# Altium schematic sheet Sheet1.SchDoc
size A2; SheetNumber: 1; SheetTotal: 1
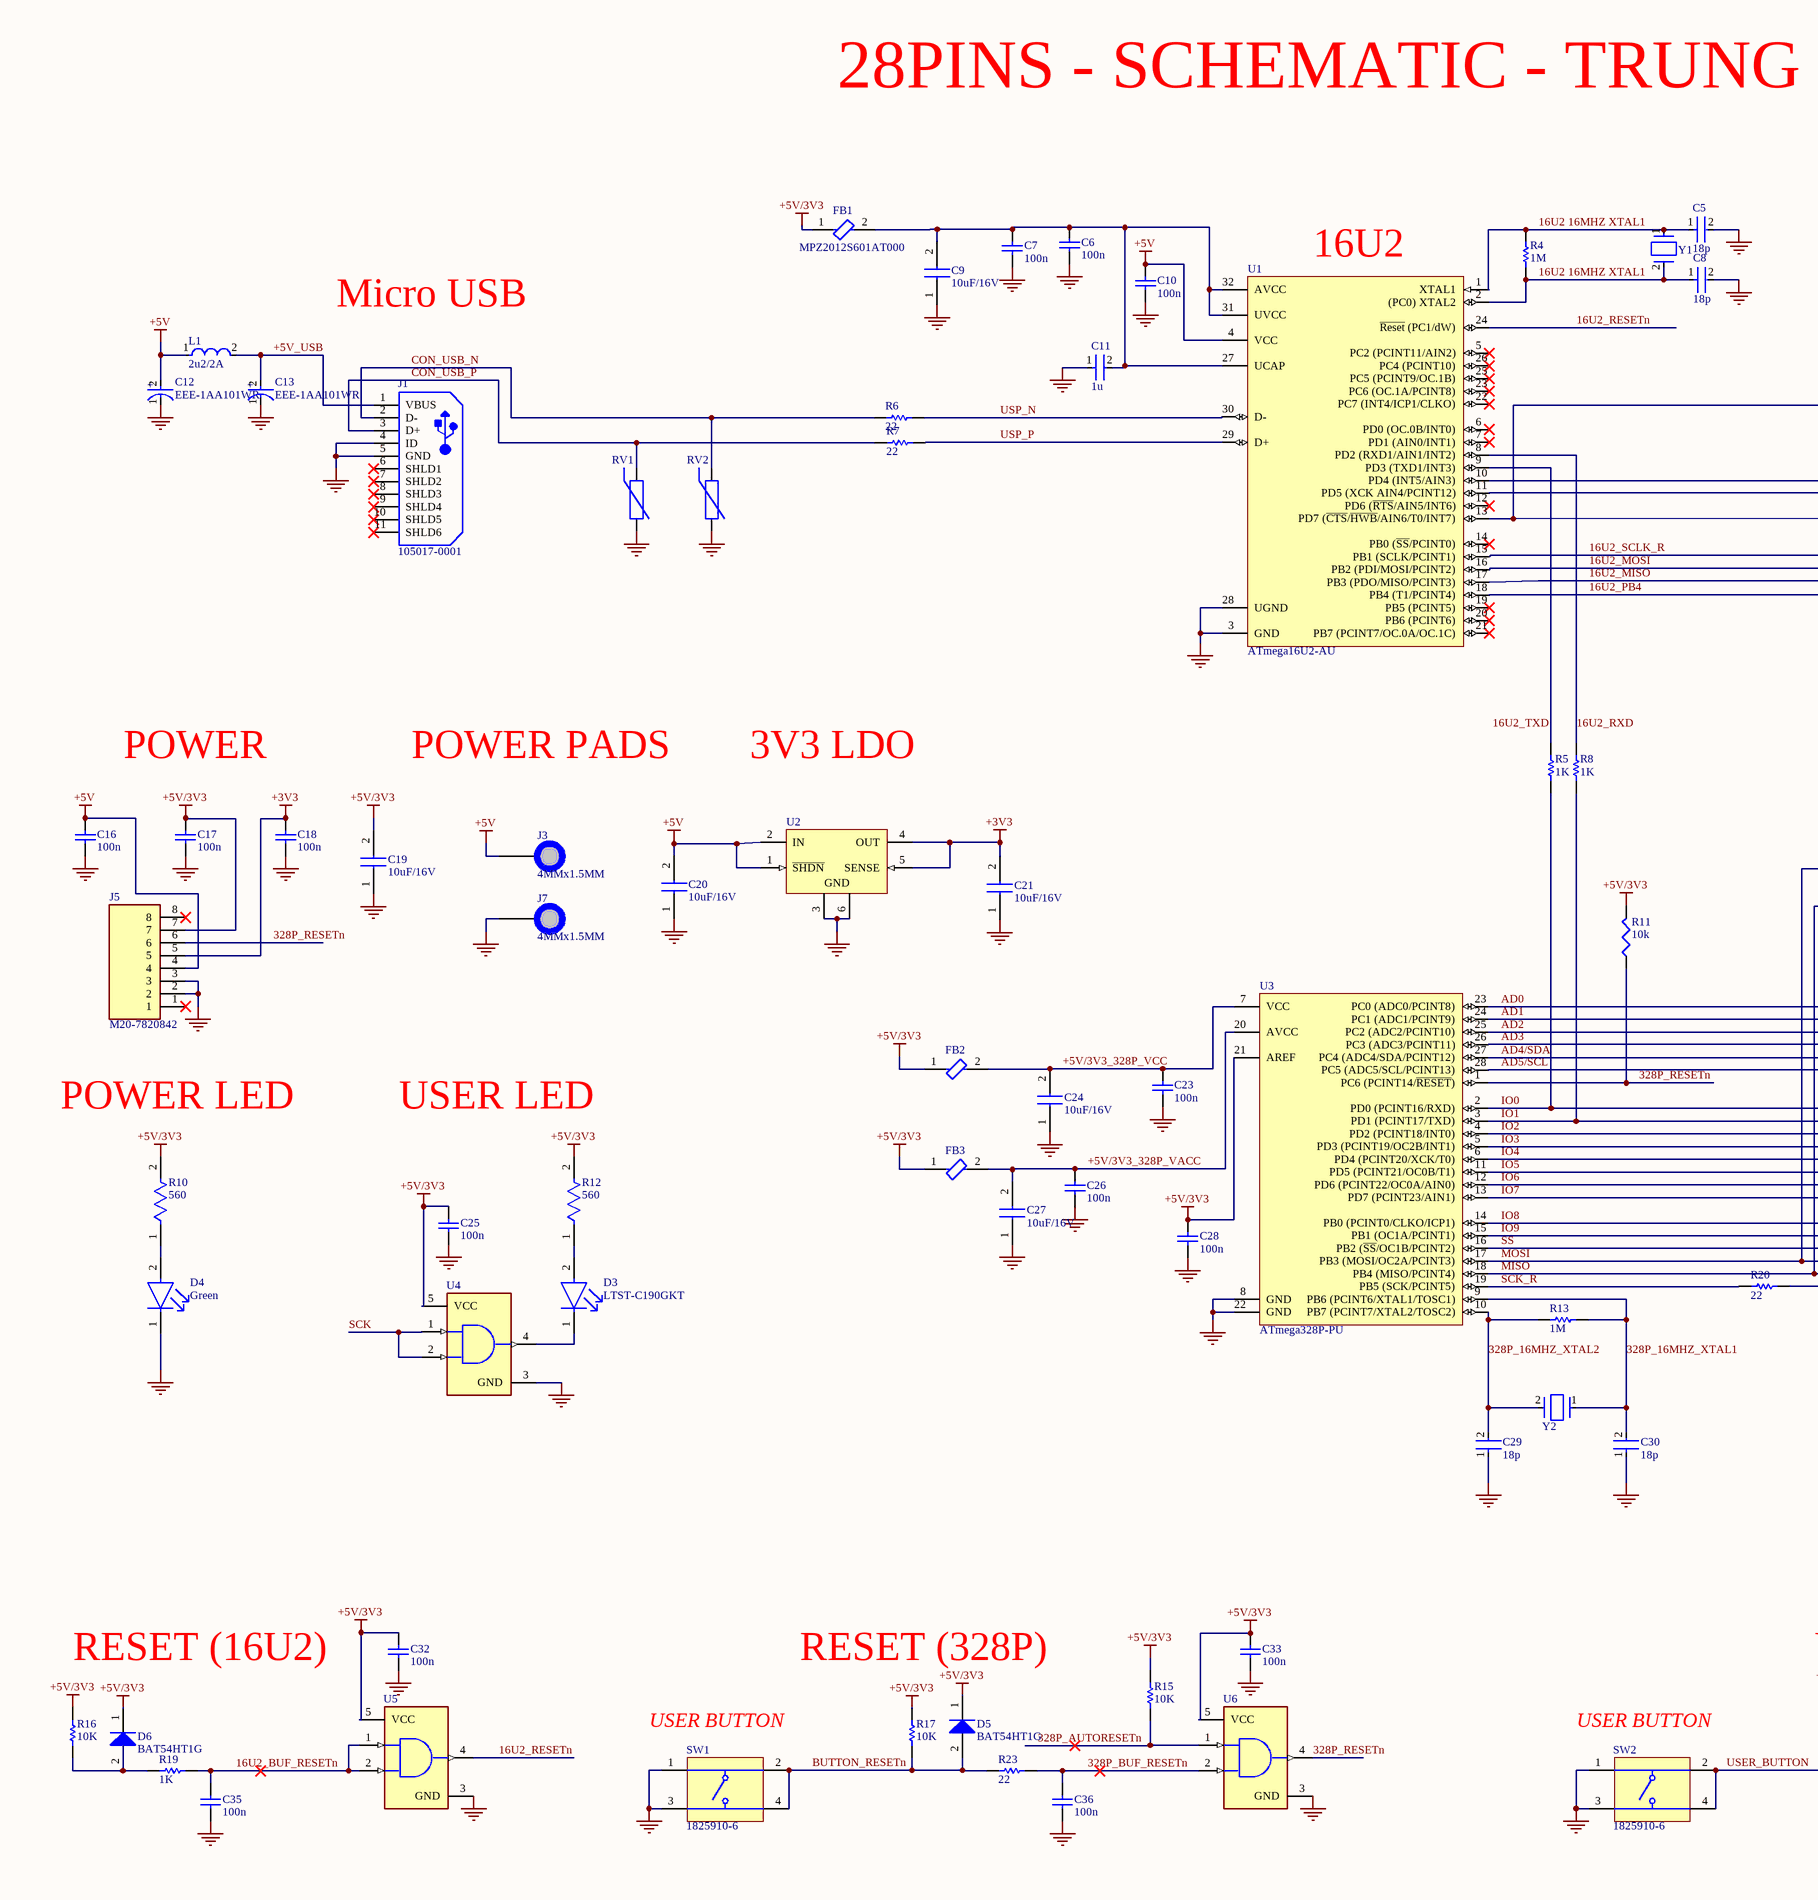
[diagram p0: Sheet1.SchDoc, left]
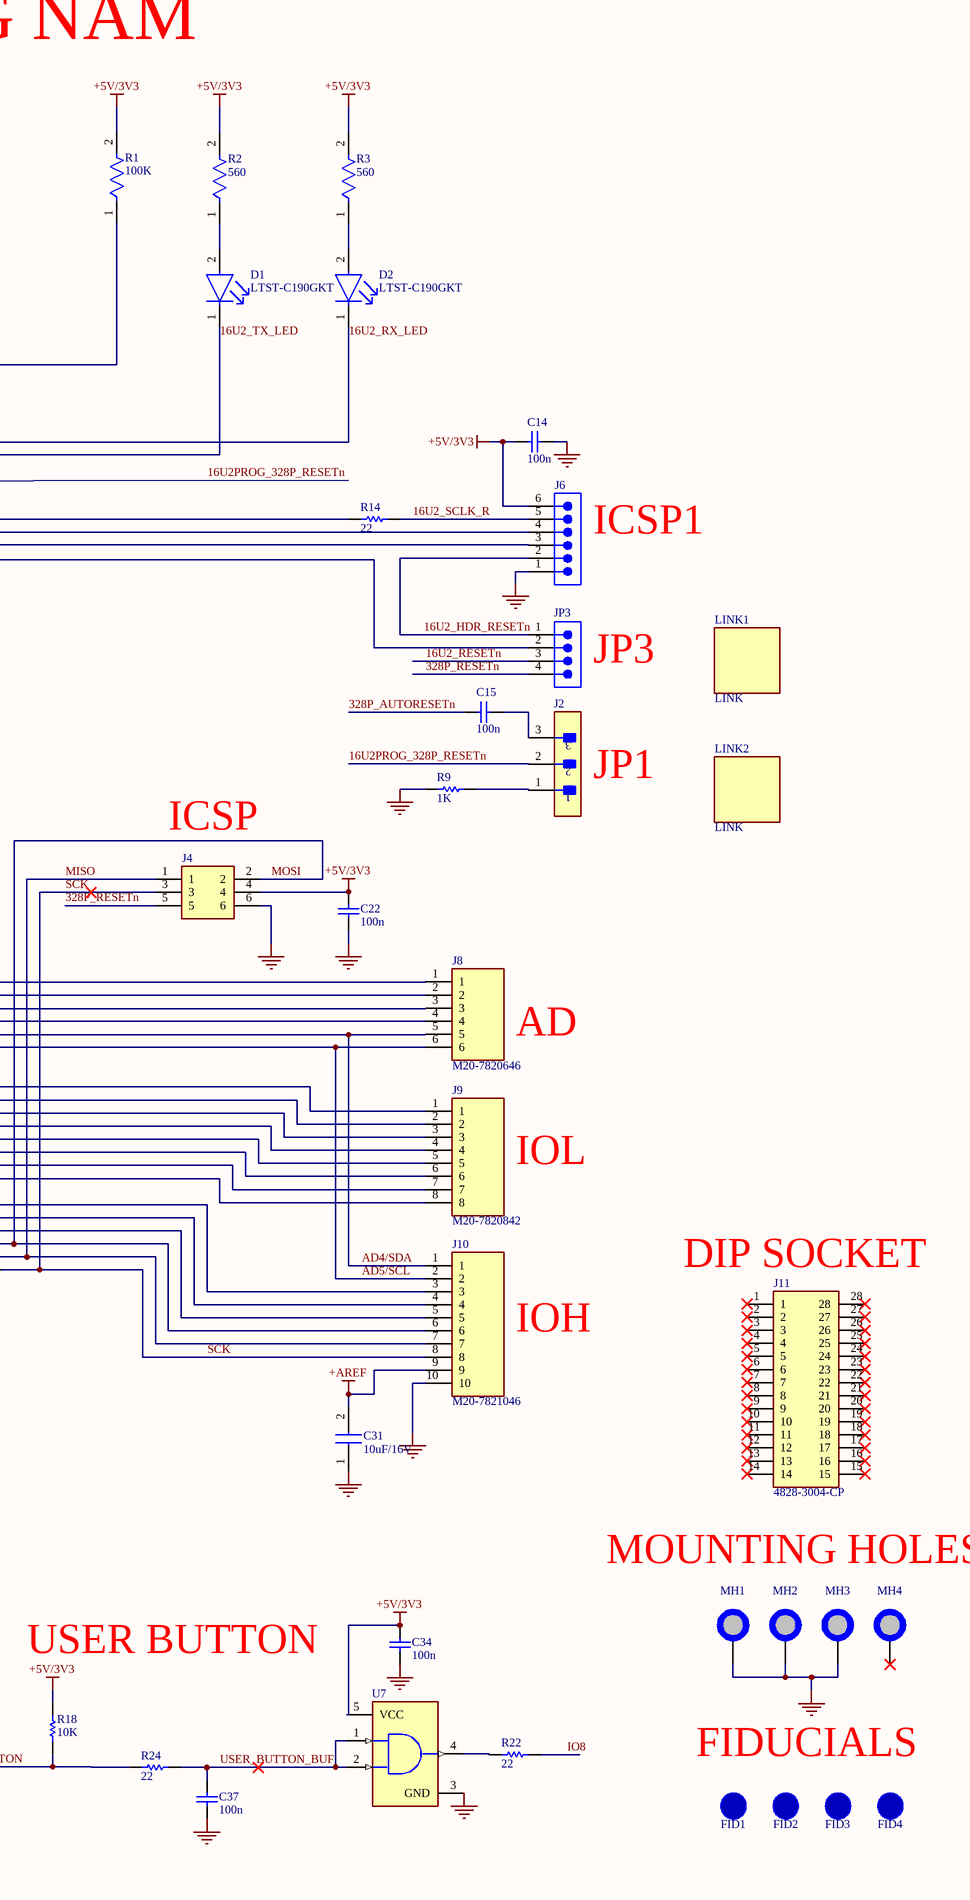
[diagram p1: Sheet1.SchDoc, right]

## Parts
C5  18p  [FP-C0805C-DN-MFG]
C6  100n  [CAPC2013X145X20LL20]
C7  100n  [CAPC2013X145X20LL20]
C8  18p  [FP-C0805C-DN-MFG]
C9  10uF/16V  [CAPC2012X145N]
C10  100n  [CAPC2013X145X20LL20]
C11  1u  [FP-C2012-125-0_2-IPC_A]
C12  EEE-1AA101WR  [FP-SC-MFG]
C13  EEE-1AA101WR  [FP-SC-MFG]
C14  100n  [CAPC2013X145X20LL20]
C15  100n  [CAPC2013X145X20LL20]
C16  100n  [CAPC2013X145X20LL20]
C17  100n  [CAPC2013X145X20LL20]
C18  100n  [CAPC2013X145X20LL20]
C19  10uF/16V  [CAPC2012X145N]
C20  10uF/16V  [CAPC2012X145N]
C21  10uF/16V  [CAPC2012X145N]
C22  100n  [CAPC2013X145X20LL20]
C23  100n  [CAPC2013X145X20LL20]
C24  10uF/16V  [CAPC2012X145N]
C25  100n  [CAPC2013X145X20LL20]
C26  100n  [CAPC2013X145X20LL20]
C27  10uF/16V  [CAPC2012X145N]
C28  100n  [CAPC2013X145X20LL20]
C29  18p  [FP-C0805C-DN-MFG]
C30  18p  [FP-C0805C-DN-MFG]
C31  10uF/16V  [CAPC2012X145N]
C32  100n  [CAPC2013X145X20LL20]
C33  100n  [CAPC2013X145X20LL20]
C34  100n  [CAPC2013X145X20LL20]
C35  100n  [CAPC2013X145X20LL20]
C36  100n  [CAPC2013X145X20LL20]
C37  100n  [CAPC2013X145X20LL20]
D1  LTST-C190GKT  [FP-LTST-C190GKT-MFG]
D2  LTST-C190GKT  [FP-LTST-C190GKT-MFG]
D3  LTST-C190GKT  [FP-LTST-C190GKT-MFG]
D4  Green  [FP-LTST-C190GKT-MFG]
D5  BAT54HT1G  [ONSC-SOD-323-2-477-02_V]
D6  BAT54HT1G  [ONSC-SOD-323-2-477-02_V]
FB1  MPZ2012S601AT000  [FP-MPZ2012-MFG]
FB2  MPZ2012S601AT000  [FP-MPZ2012-MFG]  (value not drawn)
FB3  MPZ2012S601AT000  [FP-MPZ2012-MFG]  (value not drawn)
FID1  FID_1MMC  [FID_40X120D]  (value not drawn)  (no BOM)
FID2  FID_1MMC  [FID_40X120D]  (value not drawn)  (no BOM)
FID3  FID_1MMC  [FID_40X120D]  (value not drawn)  (no BOM)
FID4  FID_1MMC  [FID_40X120D]  (value not drawn)  (no BOM)
J1  105017-0001  [USB-MICRO-B_V]
J2  90120-0763  [FP-90120-0763-MFG]  (value not drawn)
J3  4MMx1.5MM  [PAD_WITH_HOLE_4MMx1.5MM]  (no BOM)
J4  A2541WV-2x3P-C808D808-G15  [HDRV6W64P254_2X3_762X508X533P]  (value not drawn)
J5  M20-7820842  [RHDR8W80P0X254_1X8_2032X254X850P]
J6  HDR 1x6  [SMTC-TSW-106-07-X-S]  (value not drawn)
J7  4MMx1.5MM  [PAD_WITH_HOLE_4MMx1.5MM]  (no BOM)
J8  M20-7820646  [HDRV6W70P0X254_1X6_1564X250X865P]
J9  M20-7820842  [RHDR8W80P0X254_1X8_2032X254X850P]
J10  M20-7821046  [RHDR10W70P0X254_1X10_2580X250X865P]
J11  4828-3004-CP  [DIPS762W80P254L3543H521Q28N]
JP3  HDR 1X4  [61000418221]  (value not drawn)
L1  2u2/2A  [FP-LQH32CH_33-A2_3_2_8-MFG]
LINK1  LINK  [FP-QPC02SXGN-RC-MFG]
LINK2  LINK  [FP-QPC02SXGN-RC-MFG]
MH1  MH_7.4MMC_3.2MMD  [MH_7.4MMD_3.2MMD]  (value not drawn)  (no BOM)
MH2  MH_7.4MMC_3.2MMD  [MH_7.4MMD_3.2MMD]  (value not drawn)  (no BOM)
MH3  MH_7.4MMC_3.2MMD  [MH_7.4MMD_3.2MMD]  (value not drawn)  (no BOM)
MH4  MH_7.4MMNC_3.2MMD  [MH_7.4MMD_3.2MMD_NON_COPPER_NPTH]  (value not drawn)  (no BOM)
R1  100K  [FP-RC0805-0_6-IPC_C]
R2  560  [FP-CRCW0402-e3-IPC_B]
R3  560  [FP-CRCW0402-e3-IPC_B]
R4  1M  [RESC3116X65X40ML10T20]
R5  1K  [RESC2013X60X35ML10T20]
R6  22  [RESC1005X40X25LL05T05]
R7  22  [RESC1005X40X25LL05T05]
R8  1K  [RESC2013X60X35ML10T20]
R9  1K  [RESC2013X60X35ML10T20]
R10  560  [FP-CRCW0402-e3-IPC_B]
R11  10k  [R0805]
R12  560  [FP-CRCW0402-e3-IPC_B]
R13  1M  [RESC3116X65X40ML10T20]
R14  22  [RESC1005X40X25LL05T05]
R15  10K  [RESC2013X60X35NL10T20]
R16  10K  [RESC2013X60X35NL10T20]
R17  10K  [RESC2013X60X35NL10T20]
R18  10K  [RESC2013X60X35NL10T20]
R19  1K  [RESC2013X60X35ML10T20]
R20  22  [RESC1005X40X25LL05T05]
R22  22  [RESC1005X40X25LL05T05]
R23  22  [RESC1005X40X25LL05T05]
R24  22  [RESC1005X40X25LL05T05]
RV1  CG0603MLC-05E  [BOUR-CG0603-2_V]  (value not drawn)
RV2  CG0603MLC-05E  [BOUR-CG0603-2_V]  (value not drawn)
SW1  1825910-6  [TECO-1825910-6_V]
SW2  1825910-6  [TECO-1825910-6_V]
U1  ATmega16U2-AU  [32A_M]
U2  TL1963A-33DCQR  [DCQ0006A_L]  (value not drawn)
U3  ATmega328P-PU  [28P3]
U4  SN74AHC1G09DBVR  [FP-DBV0005A-MFG]  (value not drawn)
U5  SN74AHC1G09DBVR  [FP-DBV0005A-MFG]  (value not drawn)
U6  SN74AHC1G09DBVR  [FP-DBV0005A-MFG]  (value not drawn)
U7  SN74AHC1G09DBVR  [FP-DBV0005A-MFG]  (value not drawn)
Y1  ABM7-8.000MHZ-D2Y-T  [FP-ABM7-MFG]  (value not drawn)
Y2  ABM7-8.000MHZ-D2Y-T  [FP-ABM7-MFG]  (value not drawn)

## Nets
+3V3: C18.2 C21.2 J5.5 U2.4(OUT) U2.5(SENSE)
+5V: C10.2 C12.2(A) C16.2 C20.2 J3.1 J5.4 L1.1 U1.4(VCC) U2.1(~{SHDN}) U2.2(IN)
+5V/3V3: C14.1 C17.2 C19.2 C22.2 C25.2 C28.2 C32.2 C33.2 C34.2 D5.1(K) D6.1(K) FB1.1 FB2.1 FB3.1 J4.4 J5.7 J6.6 R1.2 R2.2 R3.2 R10.2 R11.2 R12.2 R15.2 R16.2 R17.2 R18.2 U3.21(AREF) U4.5(VCC) U5.5(VCC) U6.5(VCC) U7.5(VCC)
+AREF: C31.2 J10.9
GND: C5.2 C6.1 C7.1 C8.2 C9.1 C10.1 C11.1 C12.1(C) C13.1(C) C14.2 C16.1 C17.1 C18.1 C19.1 C20.1 C21.1 C22.1 C23.1 C24.1 C25.1 C26.1 C27.1 C28.1 C29.1 C30.1 C31.1 C32.1 C33.1 C34.1 C35.1 C36.1 C37.1 D4.1(C) J1.4(ID) J1.5(GND) J4.6 J5.2 J5.3 J6.1 J7.1 J10.10 MH1.1 MH2.1 MH3.1 R9.2 RV1.2 RV2.2 SW1.1 SW1.3 SW2.1 SW2.3 U1.3(GND) U1.28(UGND) U2.3(GND) U2.6(GND) U3.8(GND) U3.22(GND) U4.3(GND) U5.3(GND) U6.3(GND) U7.3(GND)
16U2 16MHZ XTAL1: C5.1 C8.1 R4.1 R4.2 U1.1(XTAL1) U1.2((PC0)_XTAL2) Y1.1 Y1.2
16U2_BUF_RESETn: C35.2 R19.1 U5.1(A) U5.2(B)
16U2_HDR_RESETn: J6.2 JP3.1
16U2_MISO: J6.3 U1.17(PB3_(PDO/MISO/PCINT3))
16U2_MOSI: J6.4 U1.16(PB2_(PDI/MOSI/PCINT2))
16U2_PB4: JP3.2 U1.18(PB4_(T1/PCINT4))
16U2_RESETn: JP3.3 U1.24(~{Reset}_(PC1/dW)) U5.4(Y)
16U2_RX_LED: D2.1(C) U1.10(PD4_(INT5/AIN3))
16U2_RXD: R8.2 U1.8(PD2_(RXD1/AIN1/INT2))
16U2_SCLK_R: J6.5 R14.1 R14.2 U1.15(PB1_(SCLK/PCINT1))
16U2_TX_LED: D1.1(C) U1.11(PD5_(XCK_AIN4/PCINT12))
16U2_TXD: R5.2 U1.9(PD3_(TXD1/INT3))
16U2PROG_328P_RESETn: J2.2 R1.1 U1.13(PD7_(~{CTS}/~{HWB}/AIN6/T0/INT7))
328P_16MHZ_XTAL1: C30.2 R13.1 U3.9(PB6_(PCINT6/XTAL1/TOSC1)) Y2.1
328P_16MHZ_XTAL2: C29.2 R13.2 U3.10(PB7_(PCINT7/XTAL2/TOSC2)) Y2.2
328P_AUTORESETn: C15.1 R15.1 U6.1(A)
328P_BUF_RESETn: C36.2 R23.2 U6.2(B)
328P_RESETn: J4.5 J5.6 JP3.4 R11.1 U3.1(PC6_(PCINT14/~{RESET})) U6.4(Y)
+5V/3V3_328P_VACC: C26.2 C27.2 FB3.2 U3.20(AVCC)
+5V/3V3_328P_VCC: C23.2 C24.2 FB2.2 U3.7(VCC)
+5V_USB: C13.2(A) J1.1(VBUS) L1.2
AD0: J8.1 U3.23(PC0_(ADC0/PCINT8))
AD1: J8.2 U3.24(PC1_(ADC1/PCINT9))
AD2: J8.3 U3.25(PC2_(ADC2/PCINT10))
AD3: J8.4 U3.26(PC3_(ADC3/PCINT11))
AD4/SDA: J8.5 J10.1 U3.27(PC4_(ADC4/SDA/PCINT12))
AD5/SCL: J8.6 J10.2 U3.28(PC5_(ADC5/SCL/PCINT13))
BUTTON_RESETn: D5.2(A) R17.1 R23.1 SW1.2 SW1.4
CON_USB_N: J1.2(D-) R6.1 RV2.1
CON_USB_P: J1.3(D+) RV1.1
IO0: J9.1 R5.1 U3.2(PD0_(PCINT16/RXD))
IO1: J9.2 R8.1 U3.3(PD1_(PCINT17/TXD))
IO2: J9.3 U3.4(PD2_(PCINT18/INT0))
IO3: J9.4 U3.5(PD3_(PCINT19/OC2B/INT1))
IO4: J9.5 U3.6(PD4_(PCINT20/XCK/T0))
IO5: J9.6 U3.11(PD5_(PCINT21/OC0B/T1))
IO6: J9.7 U3.12(PD6_(PCINT22/OC0A/AIN0))
IO7: J9.8 U3.13(PD7_(PCINT23/AIN1))
IO8: J10.3 R22.2 U3.14(PB0_(PCINT0/CLKO/ICP1))
IO9: J10.4 U3.15(PB1_(OC1A/PCINT1))
MISO: J4.1 J10.7 U3.18(PB4_(MISO/PCINT4))
MOSI: J4.2 J10.6 U3.17(PB3_(MOSI/OC2A/PCINT3))
SCK: J4.3 J10.8 R20.2 U4.1(A) U4.2(B)
SCK_R: R20.1 U3.19(PB5_(SCK/PCINT5))
SS: J10.5 U3.16(PB2_(~{SS}/OC1B/PCINT2))
USER_BUTTON: R18.1 R24.1 SW2.2 SW2.4
USER_BUTTON_BUF: C37.2 R24.2 U7.1(A) U7.2(B)
USP_N: R6.2 U1.30(D-)
USP_P: R7.2 U1.29(D+)
NetC6_2: C6.2 C7.2 C9.2 C11.2 FB1.2 U1.27(UCAP) U1.31(UVCC) U1.32(AVCC)
NetC15_2: C15.2 J2.3
NetD1_2: D1.2(A) R2.1
NetD2_2: D2.2(A) R3.1
NetD3_1: D3.1(C) U4.4(Y)
NetD3_2: D3.2(A) R12.1
NetD4_2: D4.2(A) R10.1
NetD6_2: D6.2(A) R16.1 R19.2
NetJ2_1: J2.1 R9.1
NetR22_1: R22.1 U7.4(Y)

Not connected (* = marked no-connect by the designer): J1 6(SHLD1)* 7(SHLD2)* 8(SHLD3)* 9(SHLD4)* 10(SHLD5)* 11(SHLD6)*; J5 1* 8*; J11 1* 2* 3* 4* 5* 6* 7* 8* 9* 10* 11* 12* 13* 14* 15* 16* 17* 18* 19* 20* 21* 22* 23* 24* 25* 26* 27* 28*; MH4 1*; R7 1; U1 5(PC2_(PCINT11/AIN2))* 6(PD0_(OC.0B/INT0))* 7(PD1_(AIN0/INT1))* 12(PD6_(~{RTS}/AIN5/INT6))* 14(PB0_(~{SS}/PCINT0))* 19(PB5_(PCINT5))* 20(PB6_(PCINT6))* 21(PB7_(PCINT7/OC.0A/OC.1C))* 22(PC7_(INT4/ICP1/CLKO))* 23(PC6_(OC.1A/PCINT8))* 25(PC5_(PCINT9/OC.1B))* 26(PC4_(PCINT10))*

## Notes on the sheet
- 28PINS - SCHEMATIC - TRUNG NAM
- (near U1) 16U2
- Micro USB
- (near J6) ICSP1
- (near JP3) JP3
- POWER
- POWER PADS
- 3V3 LDO
- (near J4) ICSP
- (near J2) JP1
- POWER LED
- USER LED
- AD
- IOL
- (near J11) DIP SOCKET
- IOH
- MOUNTING HOLES
- RESET (16U2)
- RESET (328P)
- (near R18) USER BUTTON
- (near SW1) USER BUTTON
- (near SW2) USER BUTTON
- FIDUCIALS
- (in symbol CMP-05427-000047-1) +

## Library data of the parts
C5 C8 C29 C30 = CMP-2007-00302-2: CAP CER 18PF 50V C0G/NP0 0805; Manufacturer: KEMET; Manufacturer Part Number: C0805C180J5GACTU; Temperature Characteristic: C0G; Tolerance: 0.05; Material: Ceramic; Temperature Coefficient: 30ppm/°C; Device Class L2: Capacitors; Capacitance: 18 pF; Temperature: -55°C to +125°C; Value: 18 pF; Package: C0805C-DN; Mouser Description: Cap Ceramic 18pF 50V C0G 5% SMD 0805 125C Paper T/R; Height: 0.88mm; ComponentLink2URL: https://content.kemet.com/datasheets/KEM_C1003_C0G_SMD.pdf; RoHS: TRUE; Octopart: https://octopart.com/c0805c180j5gactu-kemet-144810; ComponentLink2Description: Datasheet; Temperature Range High: +125°C; Digikey Description: CAP CER 18PF 50V C0G/NP0 0805; Device Class L1: Passive Components; Category: Cap; Automotive: No; Device Class L3: Ceramic Capacitors; Voltage Rating: 50 V; Temperature Range Low: -55°C; Ipc Land Pattern Name: CAPC200125X78; Lead Free: Yes
C6 C7 C10 C14-C18 C22 C23 C25 C26 C28 C32-C37 = CMP-2000-07557-1: Chip Capacitor, 0.1 uF, +/- 10%, 50 V, -55 to 125 degC, 0805 (2012 Metric), RoHS, Tape and Reel; Manufacturer: TDK; Voltage Rating: 50V; Dielectric Material: Ceramic; Capacitance: 100nF; Dielectric: X7R; Datasheet Version: 07/2017; Max Operating Temperature: 125degC; RoHSCompliant: True; Min Operating Temperature: -55degC; Case/Package: 0805; Composition: Ceramic; Width: 0.049inch; Thickness: 0.037inch; Datasheet URL: https://product.tdk.com/info/en/catalog/datasheets/mlcc_commercial_general_en.pdf; Height: 0.85mm; Voltage Rating (DC): 50V; Voltage: 50V; Packaging: TapeandReel; Mounting Technology: SurfaceMount; Case Code (Metric): 2012; Length: 2mm; Radiation Hardening: No; Number of Pins: 2; REACH SVHC: NoSVHC; Lead Free: LeadFree; Package Reference: 805; Weight: 0.000194oz; Tolerance: 10%; Package Description: 2-Pin Surface Mount Device, Body 2 x 1.25 mm; Manufacturer URL: http://www.tdk.com/; Package Quantity: 1; Case Code (Imperial): 0805; Mount: SurfaceMount; Depth: 1.25mm; Termination: SMD/SMT
C9 C19-C21 C24 C27 C31 = C2012X5R1C106M125AC: Capacitor; Manufacturer_Name: TDK; Datasheet Link: https://product.tdk.com/info/en/catalog/datasheets/mlcc_commercial_midvoltage_en.pdf; Height: 1.45mm; Manufacturer_Part_Number: C2012X5R1C106M125AC; Mouser Part Number: 810-C2012X5R1C106M-3; Mouser Price/Stock: https://www.mouser.co.uk/ProductDetail/TDK/C2012X5R1C106M125AC?qs=LcTL%2F5vFEzHcq9TBdtOIgw%3D%3D
C11 = CMP-08246-005389-1: Multilayer Ceramic Capacitors 1μF ±10% 25V X5R SMD 0805; Capacitance: 1uF; Min Operating Temperature: -55°C; Construction: Flat; Package Quantity: 2000; Height: 1.25mm; Resistor Type: Ceramic; Case/Package: 0805; Depth: 1.25mm; Case Code (Metric): 2012; Weight: 0.000194oz; REACH SVHC: No SVHC; Dielectric: X5R; Max Operating Temperature: 85°C; Number of Pins: 2; Thickness: 0.057inch; RoHS Compliant: Yes; Radiation Hardening: No; Lead Free: Lead Free; Case Code (Imperial): 0805; Length: 2mm; Voltage Rating: 25V; Mount: Surface Mount; Voltage Rating (DC): 25V; Packaging: Tape and Reel; Dielectric Material: Ceramic; Termination: SMD/SMT; Voltage: 25V; Tolerance: 10%; Series: C; Width: 0.049inch
C12 C13 = CMP-05427-000047-1: CAP ALUM 100UF 20% 10V SMD; Life (Hours): 1000Hour; Ripple Current: 50mA; Packaging: Tape and Reel; Diameter: 5mm; Voltage Rating (DC): 10V; Mount: Surface Mount; Max Operating Temperature: 85°C; Length: 5.5mm; Case/Package: Radial; Height: 5.4mm; Construction: Cylindrical; Termination: SMD/SMT; Height - Seated (Max): 0.213inch; Series: S; Min Operating Temperature: -40°C; Capacitance: 100uF; Tolerance: 20%; Voltage Rating: 10V; Package Quantity: 1; Radiation Hardening: No; Ripple Current (AC): 50mA; Lead Free: Lead Free; RoHS Compliant: Yes; Contact Plating: Tin
D1-D4 = CMP-22017-000005-2: LED GREEN CLEAR CHIP SMD; Dominant Wavelength: 569nm; Reverse Voltage: 5V; Lens Color: Colorless; Viewing Angle: 130°; Voltage: 2V; Forward Current: 30mA; Power Dissipation: 100mW; Luminous Intensity: 6mcd; Number of LEDs: 1; Forward Voltage: 2.1V; Wavelength: 565nm; Test Current: 10mA; Min Operating Temperature: -55°C; Lens Style: Clear; Mount: Surface Mount; Width: 0.8mm; Packaging: Tape and Reel; Lens Transparency: Clear; Case Code (Metric): 1608; Depth: 0.8mm; Case Code (Imperial): 0603; Case/Package: 0603; Number of Pins: 2; Max Operating Temperature: 85°C; Lead Free: Lead Free; Number of Elements: 1; Length: 1.6mm; Height: 0.8mm; Package Quantity: 1; Power Rating: 100mW; Radiation Hardening: No; Illumination Color: Green; Color: Green
D5 D6 = CMP-1055-00462-1: Schottky Barrier Diode, 2-Pin SOD-323, Pb-Free, Tape and Reel; Manufacturer: On Semiconductor; Configuration: Single; trr Max (ns): 5; IFSM Max (A): 0.6; ComponentLink3URL: http://www.onsemi.com/pub_link/Collateral/477-02.PDF.1; PackageDescription: 2-Pin SOD, Body 1.7 x 1.25 mm; ComponentLink2URL: http://www.onsemi.cn/pub_link/Collateral/BAT54HT1-D.PDF; ComponentLink3Description: Package Specification; ComponentLink2Description: Datasheet; DatasheetVersion: Rev. 6; PackageReference: SOD-323-2-477-02; RoHS: TRUE; ComponentLink1URL: http://www.onsemi.com/; Packing: Tape and Reel; PartNumber: BAT54HT1G; Mounting Technology: Surface Mount; ComponentLink1Description: Manufacturer URL; PackageVersion: Rev. H, 03/2007
FB1-FB3 = CMP-2000-05401-2: Manufacturer Lifecycle Status: PRODUCTION; NexarPartId: 12090955; RMS Current (Irms): 2A; Test Frequency: 100MHz; Tolerance: 25%; Core Material: Ferrite; Series Resistance: 100mΩ; Impedance: 600Ω; Packaging: Digi-Reel®; Length: 2mm; Min Operating Temperature: -55°C; Width: 1.25mm; Max Width: 1.45mm; Lead Free: Lead Free; Current Rating: 2A; Case Code (Imperial): 0805; Min Length: 1.8mm; Schedule B: 8504500000, 8504500000; REACH SVHC: No SVHC; Case Code (Metric): 2012; Max DC Current: 2A; Case/Package: 0805; Lifecycle Status: Production; Min Width: 1.05mm; Mount: Surface Mount; Height: 1.0414mm; Resistance: 100mΩ; DC Resistance (DCR): 100mΩ; Max Operating Temperature: 125°C; Max Length: 2.2mm; RoHS: Compliant
FID1-FID4 = FID_1MMC: Fiducial 40mil Diameter, 120mil Mask; Supplier: Digikey
J1 = CMP-2000-05827-1: Micro-USB B Receptacle, Right Angle, Bottom Mount, Surface Mount, with Solder Tabs, -30 to 85 degC, 5-Pin USB, RoHS, Tape and Reel; Manufacturer: Molex; Featured Product: Micro-USBConnectorsUSBConnectors; Other Names: WM1399DKR; Package Version: Rev. F, 12/2012; Number of Contacts: 5; Connector Type: USB-microB; Catalog Drawings: 1050170001; 3D Model: 105017-0001.stp; Mating Products: WM17145-ND-CABLEMICROUSBBTOSTDA1.0MWM17147-ND-CABLEMICROUSBBTOSTDA2.0MWM17146-ND-CABLEMICROUSBBTOSTDA1.5M; PCN Assembly/Origin: ResinSupplier21/Oct/2015; Voltage - Max: 30V; Online Catalog: Molex-MicroUSB; Manufacturer URL: http://www.molex.com/; Package Description: 5-Leads USB, Micro B, Body 7.5 x 5 mm, Pitch 0.65 mm; Datasheet URL: http://www.molex.com/elqNow/elqRedir.htm?ref=http://www.molex.com/webdocs/datasheets/pdf/en-us/1050170001_IO_CONNECTORS.pdf; Ingress Protection: -; Datasheet Version: 03/2016; Mounting Type: BoardCutout,SurfaceMount,RightAngle; Circuits: 5; Standard Package: 1; Package Reference: MICRO-B; Package URL: http://www.molex.com/pdm_docs/sd/1050170001_sd.pdf; Category: Connectors,Interconnects; Series: -; RoHS Information: 1050170001CertofCompliance; Features: Shielded,SolderRetention; Family: USB,DVI,HDMIConnectors; Specifications: -; Gender: Receptacle; Packaging: Digi-Reel®; Mounting Technology: SurfaceMount
J2 = CMP-04776-000084-1: CONN HEADER VERT 3POS 2.54MM; Manufacturer: Molex; Voltage Rating: 350V; Number Of Contacts: 3; Conn Orientation: Vertical; Current Rating: 3A; Conn Gender: Male; Package: 90120-0763; ComponentLink2Description: Datasheet; Height: 5.8mm; Manufacturer Part Number: 90120-0763; Temperature Range High: +125°C; RoHS: TRUE; ComponentLink2URL: https://www.molex.com/webdocs/datasheets/pdf/en-us/0901200763_PCB_HEADERS.pdf; Device Class L2: Headers and Wire Housings; Temperature: -55°C to +125°C; Device Class L1: Connectors; Pitch: 2.54mm; Footprint Url: https://www.molex.com/pdm_docs/sd/901200763_sd.pdf; Device Class L3: unset; Temperature Range Low: -55°C; Number Of Rows: 1; Category: Conn; Lead Free: Yes; Mouser Description: Board-To-Board Connector, C-Grid III 90120 Series, Through Hole, Header, 3, 2.54 mm; Octopart: https://octopart.com/90120-0763-molex-655433; Contact Material: Gold,Nickel; Automotive: No; Digikey Description: CONN HEADER VERT 3POS 2.54MM
J3 J7 = PAD_WITH_HOLE_4MMx1.5MM: Pad with a hole 4mm x 1.5mm
J4 = A2541WV-2x3P-C808D808-G15: Connector; Manufacturer_Name: Changjiang Connectors; Datasheet Link: https://www.cjt.com/Upload/A2541.pdf; Height: 5.33mm; Manufacturer_Part_Number: A2541WV-2x3P-C808D808-G15
J5 J9 = M20-7820842: Connector; Manufacturer_Name: Harwin; Datasheet Link: https://cdn.harwin.com/pdfs/M20-782.pdf; Height: 8.5mm; Manufacturer_Part_Number: M20-7820842; Mouser Part Number: 855-M20-7820842; Mouser Price/Stock: https://www.mouser.co.uk/ProductDetail/Harwin/M20-7820842?qs=WS5Jv%252B%252Bx1qXOep0XOTvy2Q%3D%3D
J6 = CMP-1024-00384-1: 0.025" SQ Post Header, Through-hole, Vertical, -55 to 105 degC, 2.54 mm Pitch, 6-Pin, Male, RoHS; PartNumber: TSW-106-07-T-S; Manufacturer: Samtec; Pitch: 2.54 mm; ComponentLink3URL: http://www.samtec.com/documents/webfiles/cpdf/TSW-XXX-XX-XXX-X-XX-XXX-MKT.pdf; ComponentLink1Description: Manufacturer URL; Orientation: Vertical; ComponentLink2Description: Datasheet; ComponentLink1URL: http://www.samtec.com; RoHS: True; DatasheetVersion: F-214; PackageDescription: .025[0.64] SQ. Post Terminal Strip Assembly; Mounting Technology: Through-hole; PackageReference: TSW-106-07-X-S; PackageVersion: DM, 8/1988; ComponentLink3Description: Package Specification; ComponentLink2URL: http://www.samtec.com/documents/webfiles/pdf/TSW_TH.PDF; Temperature Range: -55 to 105 degC
J8 = M20-7820646: Connector; Manufacturer_Name: Harwin; Datasheet Link: https://cdn.harwin.com/pdfs/M20-782.pdf; Height: 8.65mm; Manufacturer_Part_Number: M20-7820646; Mouser Part Number: 855-M20-7820646; Mouser Price/Stock: https://www.mouser.co.uk/ProductDetail/Harwin/M20-7820646?qs=WS5Jv%252B%252Bx1qWZs4rbTjPGWw%3D%3D
J10 = M20-7821046: Connector; Manufacturer_Name: Harwin; Datasheet Link: https://cdn.harwin.com/pdfs/M20-782.pdf; Height: 8.65mm; Manufacturer_Part_Number: M20-7821046; Mouser Part Number: 855-M20-7821046; Mouser Price/Stock: https://www.mouser.co.uk/ProductDetail/Harwin/M20-7821046?qs=Jph8NoUxIfXTsFl0wvOA6g%3D%3D
J11 = 4828-3004-CP: Connector; Manufacturer_Name: 3M; Datasheet Link: http://multimedia.3m.com/mws/media/218496O/3mtm-dip-socket-4800-series-ts1099.pdf; Height: 5.207mm; Manufacturer_Part_Number: 4828-3004-CP; Mouser Part Number: 517-4828-3004-CP; Mouser Price/Stock: https://www.mouser.co.uk/ProductDetail/3M-Electronic-Solutions-Division/4828-3004-CP?qs=mroHWPoUHBolYNJsg4b2PQ%3D%3D; Arrow Part Number: 4828-3004-CP; Arrow Price/Stock: https://www.arrow.com/en/products/4828-3004-cp/3m?utm_currency=USD&region=nac
JP3 = CMP-1502-01019-4: NexarPartId: 32855425; Voltage Rating: 250V; Gender: Male; Number of Contacts: 4; Connector Type: Male Pin; Current Rating: 3A; Contact Resistance: 20mΩ; Pitch: 2.54mm; Color: Black; Mount: Surface Mount; Height: 9.7mm; Number of Rows: 1; Max Operating Temperature: 105°C; RoHS: Compliant; Termination: Solder; Contact Mating Length: 5.9944mm; REACH SVHC: Unknown; Contact Plating: Gold; Lead Pitch: 2.54mm; Number of Pins: 4; Orientation: Vertical; Min Operating Temperature: -40°C; Number of Positions: 4; Contact Material: Copper; Operating Supply Voltage: 250V
L1 = CMP-06042-013069-2: Wire Wound Ferrite Inductor for Power Lines 2.2μH ±20% 0.1261Ω 790mA 1210; Shielding: Unshielded; Test Frequency: 1MHz; Inductance: 2.2uH; Current: 590mA; Self Resonant Frequency: 64MHz; Q Factor: 35; DC Resistance (DCR): 97mR; Lead Free: Lead Free; Max DC Current: 790mA; RoHS Compliant: Yes; Min Operating Temperature: -40°C; Radiation Hardening: No; Packaging: Tape and Reel; Number of Pins: 2; Case/Package: 1210; Core Material: Ferrite; Inductance Tolerance: 20%; Case Code (Metric): 3225; Case Code (Imperial): 1210; Width: 2.5mm; Length: 3.2mm; Military Standard: Not; Depth: 2.5mm; Rated Current-Max: 790mA; REACH SVHC: No SVHC; Inductor Type: Wirewound; Termination: SMD/SMT; DC Current: 790mA; Current Rating: 790mA; Height: 2mm; Weight: 0.002116oz; Package Quantity: 2000; Mount: Surface Mount; Series: LQW18A_10; Max Operating Temperature: 85°C; Tolerance: 20%
LINK1 LINK2 = CMP-25666-000001-1: CONN JUMPER SHORTING .100" GOLD; Manufacturer Part Number: QPC02SXGN-RC; Manufacturer: Sullins; Conn Orientation: Straight; Pitch: 2.54mm; Current Rating: 3A; Number Of Contacts: 2; Category: Conn; Temperature Range Low: -40°C; Temperature Range High: +85°C; Device Class L1: Connectors; Lead Free: Yes; Automotive: No; Height: 6.17mm; ComponentLink2URL: https://s3.amazonaws.com/catalogspreads-pdf/PAGE128-129%20.100%20JUMPER.pdf; Device Class L2: unset; Footprint Url: https://drawings-pdf.s3.amazonaws.com/11510.pdf; Device Class L3: unset; Temperature: -40°C to +85°C; RoHS: TRUE; Digikey Description: CONN JUMPER SHORTING .100" GOLD; Octopart: https://octopart.com/qpc02sxgn-rc-sullins-19878795; Package: 0; ComponentLink2Description: Datasheet; Contact Material: Gold
MH1-MH3 = MH_7.4MMC_3.2MMD: Mounting Hole 7.4mm Diameter, 3.2mm Drill; .Creator: MM
MH4 = MH_7.4MMNC_3.2MMD: Mounting Hole 7.4mm Diameter (Non Copper), 3.2mm Drill NPTH
R1 = CMP-2100-03668-5: RES 100K OHM 1% 1/8W 0805; Power Rating: 125mW; Temperature Coefficient: 100ppm/°C; Voltage Rating (DC): 150V; Resistance: 100kR; Package Quantity: 1; Case/Package: 0805; Lead Pitch: 0.4mm; Case Code (Imperial): 0805; Construction: Rectangular; Number of Terminations: 2; RoHS Compliant: Yes; Max Power Dissipation: 125mW; Tolerance: 1%; Max Operating Temperature: 155°C; Resistance Tolerance: 1%; Lead Free: Lead Free; Packaging: Tape and Reel; Resistor Type: Thick Film; Min Operating Temperature: -55°C; Case Code (Metric): 2012; Series: RC; Technology: THICK FILM; Voltage Rating: 150V; Termination: SMD/SMT; Width: 0.049inch; Number of Pins: 2; Features: Moisture Resistant; Military Standard: Not; Length: 0.079inch; Depth: 1.25mm; Size Code: 0805; Height: 0.024inch
R2 R3 R10 R12 = CMP-2002-00097-2: RES Thick Film, 560Ω, 1%, 0.063W, 100ppm/°C, 0402; Voltage Rating (DC): 50V; Resistance: 560R; Max Power Dissipation: 63mW; Military Standard: Not; Temperature Coefficient: 100ppm/°C; Width: 0.02inch; RoHS Compliant: Yes; Termination: SMD/SMT; Package Quantity: 10; Construction: Rectangular; Number of Terminations: 2; Case Code (Metric): 1005; Resistor Type: Thick Film; Contact Plating: Tin; Number of Pins: 2; Lead Free: Lead Free; Length: 1mm; Radiation Hardening: No; Case/Package: 0402; Tolerance: 1%; Features: Automotive AEC-Q200; Depth: 0.5mm; Size Code: 0402; Packaging: Tape and Reel; Min Operating Temperature: -55°C; Weight: 2.3E-05oz; Case Code (Imperial): 0402; Max Operating Temperature: 155°C; Power Rating: 63mW; Resistance Tolerance: 1%; Height: 0.35mm; Voltage Rating: 50V; Series: CRCW; Technology: THICK FILM
R4 R13 = CMP-2003-04285-1: Manufacturer: Yageo; Part Number: RT1206BRD071ML
R5 R8 R9 R19 = CMP-2100-03671-1: Chip Resistor, 1 KOhm, +/- 1%, 125 mW, -55 to 155 degC, 0805 (2012 Metric), RoHS, Tape and Reel; Manufacturer: Yageo; Temperature Coefficient: 100ppm/degreesC; Voltage Rating (DC): 150V; Max Power Dissipation: 125mW; Resistance: 1KOhm; Number of Pins: 2; Number of Terminations: 2; Datasheet URL: http://www.yageo.com/NewPortal/yageodocoutput?fileName=/pdf/R-Chip/PYu-RC_Group_51_RoHS_L_5.pdf; Length: 0.079inch; Package Description: 2-Pin Surface Mounted Device, Body 2 x 1.25 mm; Depth: 1.25mm; Height: 0.024inch; Military Standard: Not; Case/Package: 0805; Package Reference: 0805; RoHSCompliant: true; Lead Free: LeadFree; Packaging: TapeandReel; Package Quantity: 1; Datasheet Version: Rev. 5, 10/2016; Tolerance: 1%; Min Operating Temperature: -55degC; Voltage Rating: 150V; Composition: ThickFilm; Case Code (Imperial): 0805; Power Rating: 125mW; Width: 0.049inch; Case Code (Metric): 2012; Manufacturer URL: http://www.yageo.com/; Max Operating Temperature: 155degC; REACH SVHC: Unknown; Termination: SMD/SMT
R6 R7 R14 R20 R22-R24 = CMP-2002-08382-1: Manufacturer: Vishay Dale; Part Number: CRCW040222R0FKED
R11 = RC0805FR-0710KL: RES SMD 10K OHM 1% 1/8W 0805; Manufacturer: Yageo; Power (Watts): 0.125W, 1/8W; Temperature Coefficient: ±100ppm/°C; .Creator: MM; .Checked PCB: RF; Supplier 1: Digi-Key; Manufacturer Part Number: RC0805FR-0710KL; RoHS: RoHS Compliant; Category: Resistors; Stock 1: 4094384; Pricing 1: 1=0.1, 10=0.021, 25=0.0148, 100=0.0084, 250=0.0064, 500=0.0051, 1000=0.00376, 2500=0.00326 (USD); Packaging: Cut Tape (CT); Resistance (Ohms): 10k; Tolerance: ±1%; Composition: Thick Film; Features: Moisture Resistant; Operating Temperature: -55°C ~ 155°C; Package / Case: 0805 (2012 Metric); Supplier Device Package: 0805; Size / Dimension: 0.079" L x 0.049" W (2.00mm x 1.25mm); Height: 0.024" (0.60mm); Number of Terminations: 2; ComponentLink1URL: http://www.yageo.com/documents/recent/PYu-RC_Group_51_RoHS_L_1.pdf; ComponentLink1Description: http://www.yageo.com/documents/recent/PYu-RC_Group_51_RoHS_L_1.pdf; Supplier Part Number 1: 311-10.0KCRCT-ND; .Checked SCH: RF
R15-R18 = CMP-1659-00013-4: Chip Resistor, 10 KOhm, +/- 1%, 0.125 W, -55 to 155 degC, 0805 (2012 Metric), RoHS, Tape and Reel; Manufacturer: Yageo; Voltage Rating: 150 V; Mount: Surface Mount; ComponentLink1Description: Manufacturer URL; ComponentLink2URL: http://www.yageo.com/documents/recent/PYu-RC_Group_51_RoHS_L_04.pdf; Pins: 2; Length: 2 mm; Min Operating Temperature: -55 degC; Height: 0.5 mm; Mounting Technology: Surface Mount; RoHSCompliant: true; REACH SVHC: No SVHC; ComponentLink1URL: http://www.yageo.com/; Max Operating Temperature: 155 degC; PackageReference: 0805; DatasheetVersion: Rev. 4, 02/2016; Package Quantity: 5000; Packaging: Tape and Reel; ComponentLink2Description: Datasheet; PackageDescription: 2-Pin Surface Mounted Device, Body 2 x 1.25 mm
RV1 RV2 = CMP-0584-00001-2: ESD Protector, 5 V Supply, -40 to 85 degC, 1.6 x 0.8 x 0.55 mm SMD, RoHS, Tape and Reel; Manufacturer: Bourns; VC: 20 V; VT: 150 V; RT: 1 ns; VDC: 5 V; CO: 0.5 pF; PartNumber: CG0603MLC-05E; ComponentLink1Description: Manufacturer URL; ComponentLink1URL: http://www.bourns.com/; Packing: Tape and Reel; Mounting Technology: Surface Mount; ComponentLink2Description: Datasheet; RoHS: TRUE; Operating Temperature: -40 to 85 degC; DatasheetVersion: Rev. S; PackageDescription: 2-Pin SMD, Body 1.6 x 0.8 mm, Pitch 1.52 mm; PackageReference: CG0603-2; ComponentLink2URL: http://www.bourns.com/data/global/pdfs/MLC.pdf
SW1 SW2 = CMP-1684-00021-1: Tact Switch, SPST-NO, 0.05 A, -35 to 85 degC, 4-Pin THD, RoHS, Bulk; Manufacturer: TE Connectivity; Maximum Contact Resistance: 100mOhm; Mechanical Life: 100000Cycles; Bushing Type: Unthreaded; Switch Configuration: OFF(ON); Maximum DC Voltage Rating: 24V; Contact Rating @ Voltage: 0.05A@24VDC; Actuator Color: Black; Body Orientation: Straight; Function: MomentaryContact; Illumination: N/R; Actuator Style: RoundButton; Actuator Material: PolybutyleneTerephthalate; Dielectric Strength: 500VAC; Pole Throw Configuration: SPST; Actuator Length: 1.4mm; Product Weight: N/A; Contact Material: CopperAlloy; Housing Material: N/A; Terminal Type: PCPins; Minimum Insulation Resistance: 100MOhm; Package Description: 4-Pin Through Hole Device, Body 5.99 x 5.99 mm, Pitch 6.5 mm; Part No: 1825910-6; Package Reference: THD; Base Material: N/A; Manufacturer URL: http://www.te.com; Contact Plating: Silver; RoHS: Yes; Datasheet Version: Rev. C9; Electrical Life: 100000Cycles; Maximum AC Voltage Rating: N/A; Thread Size: N/R; Operating Temperature: -35to85C; Mounting: ThroughHole; Dimension: 5.99x5mm; Datasheet URL: http://www.te.com/commerce/DocumentDelivery/DDEController?Action=showdoc&DocId=Customer+Drawing%7F1825910%7FC9%7Fpdf%7FEnglish%7FENG_CD_1825910_C9.pdf%7F1825910-6; Family: 1825910; Seal Location: N/A; Seal Description: N/A; Packaging: N/A
U1 = CMP-0095-00303-3: 8-bit AVR Microcontroller, 2.7-5.5V, 16KB Flash, 512 Bytes EEPROM, 512 Bytes SRAM, 32-pin TQFP, Industrial Grade (-40°C to 85°C); RevisionNote: Schematic symbol corrected; PartNumber: ATmega16U2-AU; ComponentLink1URL: http://www.atmel.com/; ComponentLink2Description: ATmega8U2/16U2/32U2 Datasheet; PackageDescription: 32-Lead, 7x7x1.0 mm Body, 0.8mm Lead Pitch, Thin Profile Plastic Quad Flat Package (TQFP); Code_JEDEC: MS-026-ABA; DatasheetVersion: revD, Nov-2010; ComponentLink2URL: http://www.atmel.com/dyn/resources/prod_documents/doc7799.pdf; ComponentLink3URL: http://www.atmel.com/dyn/resources/prod_documents/7799S.pdf; ComponentLink3Description: ATmega8U2/16U2/32U2 Summary; PackageReference: 32A; PackageVersion: revC, Oct-2010; ComponentLink1Description: Manufacturer URL
U2 = CMP-0395-00346-2: Single Output Low Noise LDO, 1.5 A, Fixed 3.3 V Output, 2.1 to 20 V Input, 6-pin SOT-223 (DCQ), -40 to 125 degC, Green (RoHS & no Sb/Br); Manufacturer: Texas Instruments; Iq(Typ)(mA): 1; Fixed Output Options(V): 3.3; Iout(Max)(A): 1.5; Vin(Min)(V): 2.1; SubFamily: Single Channel LDO; Vin(Max)(V): 20; Vdo(Typ)(mV): 340; Accuracy(%): 3; PackageDescription: 6-Pin Plastic Small Outline, Body 3.5 x 6.5 mm, Pitch 1.27 mm; ComponentLink3URL: http://www.ti.com/litv/pdf/mpds098c; DatasheetVersion: SLVS719F; Eco-Plan: Green (RoHS & no Sb/Br); ComponentLink1Description: Manufacturer URL; ComponentLink2URL: http://www.ti.com/general/docs/lit/getliterature.tsp?genericPartNumber=TL1963A-33&fileType=pdf; ComponentLink1URL: http://www.ti.com/; ComponentLink2Description: Datasheet; PackageVersion: 4202109/D; Mounting Technology: Surface Mount; Vout Adj(Min)(V): 3.3; ComponentLink3Description: Package Specification; Vout Adj(Max)(V): 3.3; PackageReference: DCQ0006A; PartNumber: TL1963A-33DCQR
U3 = CMP-0095-00013-2: 8-bit AVR Microcontroller, 32KB Flash, 1KB EEPROM, 2KB SRAM, 28-pin PDIP, Industrial Grade (-40°C to 85°C); RevisionNote: DatasheetVersion updated. URLs added.; PackageVersion: revB, Sep-2001; PackageDescription: 28-lead (0.300"/7.62mm Wide) Plastic Dual Inline Package (PDIP); DatasheetVersion: revD, May-2011; ComponentLink1Description: Manufacturer URL; ComponentLink1URL: http://www.atmel.com/; PackageReference: 28P3; ComponentLink2Description: ATmega48A/48PA/88A/88PA/168A/168PA/328/328P Datasheet; ComponentLink3URL: http://www.atmel.com/dyn/resources/prod_documents/8271S.pdf; ComponentLink2URL: http://www.atmel.com/dyn/resources/prod_documents/8271.pdf; ComponentLink3Description: ATmega48A/48PA/88A/88PA/168A/168PA/328/328P Summary
U4-U7 = CMP-0859-00040-4: IC GATE AND 1CH 2-INP SOT23-5; Manufacturer: Texas Instruments; Number Of Outputs: 1; Standoff Height: 0mm; Max Supply Voltage: 5.5V; Nominal Supply Current: 1uA; Min Supply Voltage: 2V; Max Junction Temp: +150°C; Propagation Delay: 4.6ns; Number Of Inputs: 2; ComponentLink2Description: Datasheet; Temperature: -55°C to +125°C; Ambient Temperature Range High: +125°C; Logic Function Desc: AND; Device Class L1: Integrated Circuits (ICs); Height: 1.45mm; Device Class L3: Logic Gates; ComponentLink2URL: http://www.ti.com/lit/ds/symlink/sn74ahc1g09.pdf; Ambient Temperature Range Low: -55°C; RoHS: TRUE; Mouser Description: IC GATE AND 1CH 2-INP SOT-23-5; Temperature Range Low: -55°C; Digikey Description: IC GATE AND 1CH 2-INP SOT23-5; Ipc Land Pattern Name: SOT95P280X145-5; Octopart: https://octopart.com/sn74ahc1g09dbvr-texas+instruments-20351419; Device Class L2: Logic ICs; Manufacturer Part Number: SN74AHC1G09DBVR; Category: IC; Package: DBV0005A; Automotive: No; Lead Free: Yes; Number Of Circuits: 1; Temperature Range High: +125°C
Y1 Y2 = CMP-2000-05034-2: Crystal 8MHz ±20ppm 18pF SMD-2 6mm x 3.5mm; ESR (Equivalent Series Resistance): 100R; Series Resistance: 80R; Frequency Stability: 30ppm; Resistor Type: Ceramic; Radiation Hardening: No; Height: 0.055inch; Packaging: Tape and Reel; Lead Free: Lead Free; Min Operating Temperature: -40°C; Termination: SMD/SMT; REACH SVHC: Yes; Number of Pins: 2; Mount: Surface Mount; Case/Package: CSMD; Tolerance: 20ppm; Max Operating Temperature: 85°C; Series: ABM7; Frequency Tolerance: 20ppm; Load Capacitance: 18pF; Length: 6mm; Frequency: 8MHz; Width: 0.138inch; Package Quantity: 1000; Depth: 3.5mm; Operating Frequency: 8 MHz